# Altium schematic sheet Instigator2012ControllerBoard.SchDoc
size Letter; DocumentNumber: 1; SheetNumber: 1; SheetTotal: 4
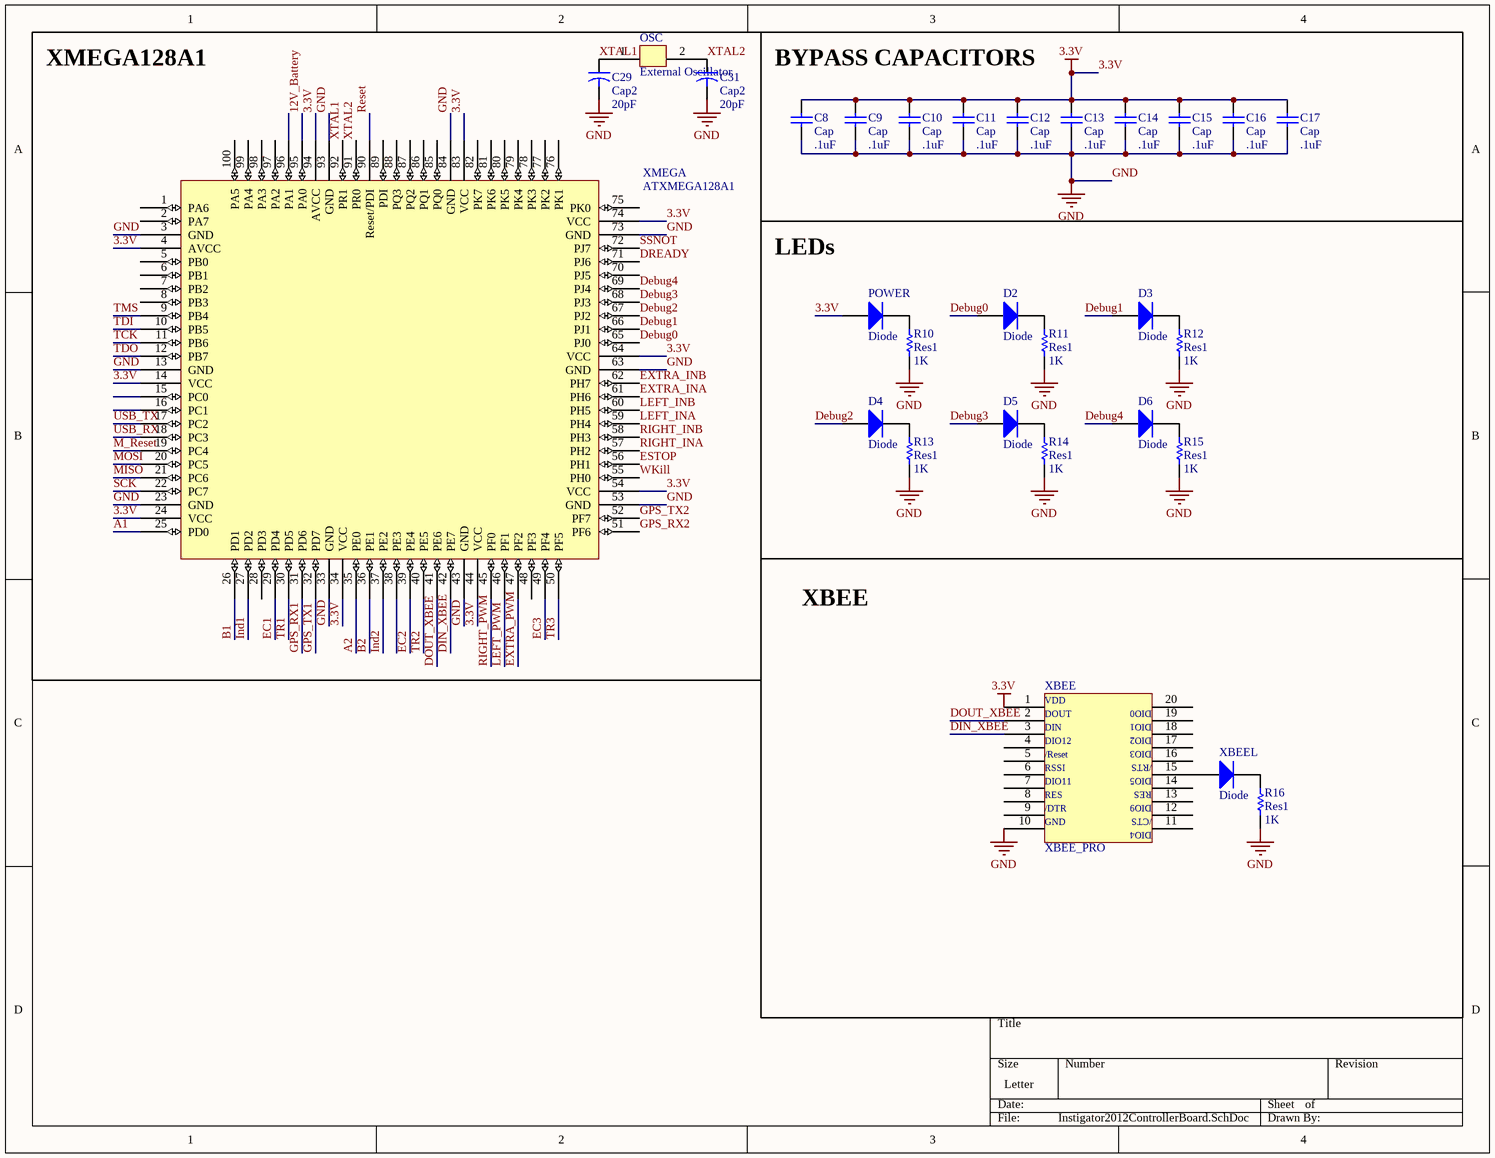
[diagram p0: Instigator2012ControllerBoard.SchDoc]

## Parts
C8  Cap  value .1uF  [1608[0603]]
C9  Cap  value .1uF  [1608[0603]]
C10  Cap  value .1uF  [1608[0603]]
C11  Cap  value .1uF  [1608[0603]]
C12  Cap  value .1uF  [1608[0603]]
C13  Cap  value .1uF  [1608[0603]]
C14  Cap  value .1uF  [1608[0603]]
C15  Cap  value .1uF  [1608[0603]]
C16  Cap  value .1uF  [1608[0603]]
C17  Cap  value .1uF  [1608[0603]]
C29  Cap2  value 20pF  [1608[0603]]
C31  Cap2  value 20pF  [1608[0603]]
D2  Diode  [1608[0603]]
D3  Diode  [1608[0603]]
D4  Diode  [1608[0603]]
D5  Diode  [1608[0603]]
D6  Diode  [1608[0603]]
OSC  External Oscillator  [PCBComponent_1 - duplicate3]
POWER  Diode  [1608[0603]]
R10  Res1  value 1K  [1608[0603]]
R11  Res1  value 1K  [1608[0603]]
R12  Res1  value 1K  [1608[0603]]
R13  Res1  value 1K  [1608[0603]]
R14  Res1  value 1K  [1608[0603]]
R15  Res1  value 1K  [1608[0603]]
R16  Res1  value 1K  [1608[0603]]
XBEE  XBEE_PRO  [PCBComponent_1]
XBEEL  Diode  [1608[0603]]
XMEGA  ATXMEGA128A1  [TSQFP50P1600X1600X120-100N]

## Blocks framed on the sheet
XMEGA128A1: C29 C31 OSC XMEGA

## Nets
3.3V: C8.2 C9.2 C10.2 C11.2 C12.2 C13.2 C14.2 C15.2 C16.2 C17.2 POWER.1(A) XBEE.1 XMEGA.4(AVCC) XMEGA.14(VCC) XMEGA.24(VCC) XMEGA.34(VCC) XMEGA.44(VCC) XMEGA.54(VCC) XMEGA.64(VCC) XMEGA.74(VCC) XMEGA.83(VCC) XMEGA.94(AVCC)
GND: C8.1 C9.1 C10.1 C11.1 C12.1 C13.1 C14.1 C15.1 C16.1 C17.1 C29.2 C31.2 R10.1 R11.1 R12.1 R13.1 R14.1 R15.1 R16.1 XBEE.10 XMEGA.3(GND) XMEGA.13(GND) XMEGA.23(GND) XMEGA.33(GND) XMEGA.43(GND) XMEGA.53(GND) XMEGA.63(GND) XMEGA.73(GND) XMEGA.84(GND) XMEGA.93(GND)
12V_Battery: XMEGA.95(PA0)
A1: XMEGA.25(PD0)
A2: XMEGA.35(PE0)
B1: XMEGA.26(PD1)
B2: XMEGA.36(PE1)
Debug0: D2.1(A) XMEGA.65(PJ0)
Debug1: D3.1(A) XMEGA.66(PJ1)
Debug2: D4.1(A) XMEGA.67(PJ2)
Debug3: D5.1(A) XMEGA.68(PJ3)
Debug4: D6.1(A) XMEGA.69(PJ4)
DIN_XBEE: XBEE.3 XMEGA.42(PE7)
DOUT_XBEE: XBEE.2 XMEGA.41(PE6)
DREADY: XMEGA.71(PJ6)
EC1: XMEGA.29(PD4)
EC2: XMEGA.39(PE4)
EC3: XMEGA.49(PF4)
ESTOP: XMEGA.56(PH1)
EXTRA_INA: XMEGA.61(PH6)
EXTRA_INB: XMEGA.62(PH7)
EXTRA_PWM: XMEGA.47(PF2)
GPS_RX1: XMEGA.31(PD6)
GPS_RX2: XMEGA.51(PF6)
GPS_TX1: XMEGA.32(PD7)
GPS_TX2: XMEGA.52(PF7)
Ind1: XMEGA.27(PD2)
Ind2: XMEGA.37(PE2)
LEFT_INA: XMEGA.59(PH4)
LEFT_INB: XMEGA.60(PH5)
LEFT_PWM: XMEGA.46(PF1)
M_Reset: XMEGA.19(PC4)
MISO: XMEGA.21(PC6)
MOSI: XMEGA.20(PC5)
Reset: XMEGA.90(Reset/PDI)
RIGHT_INA: XMEGA.57(PH2)
RIGHT_INB: XMEGA.58(PH3)
RIGHT_PWM: XMEGA.45(PF0)
SCK: XMEGA.22(PC7)
SSNOT: XMEGA.72(PJ7)
TCK: XMEGA.11(PB6)
TDI: XMEGA.10(PB5)
TDO: XMEGA.12(PB7)
TMS: XMEGA.9(PB4)
TR1: XMEGA.30(PD5)
TR2: XMEGA.40(PE5)
TR3: XMEGA.50(PF5)
USB_RX: XMEGA.18(PC3)
USB_TX: XMEGA.17(PC2)
WKill: XMEGA.55(PH0)
XTAL1: C29.1 OSC.1 XMEGA.92(PR1)
XTAL2: C31.1 OSC.2 XMEGA.91(PR0)
NetD2_2: D2.2(K) R11.2
NetD3_2: D3.2(K) R12.2
NetD4_2: D4.2(K) R13.2
NetD5_2: D5.2(K) R14.2
NetD6_2: D6.2(K) R15.2
NetPOWER_2: POWER.2(K) R10.2
NetR16_2: R16.2 XBEEL.2(K)
NetXBEE_15: XBEE.15 XBEEL.1(A)

Not connected (* = marked no-connect by the designer): XBEE 4 5 6 7 8 9 11 12 13 14 16 17 18 19 20; XMEGA 1(PA6) 2(PA7) 5(PB0) 6(PB1) 7(PB2) 8(PB3) 15(PC0) 16(PC1) 28(PD3) 38(PE3) 48(PF3) 70(PJ5) 75(PK0) 76(PK1) 77(PK2) 78(PK3) 79(PK4) 80(PK5) 81(PK6) 82(PK7) 85(PQ0) 86(PQ1) 87(PQ2) 88(PQ3) 89(PDI) 96(PA1) 97(PA2) 98(PA3) 99(PA4) 100(PA5)

## Notes on the sheet
- BYPASS CAPACITORS
- LEDs
- XBEE
- (in symbol XBEE) VDD; DIO0; DOUT; DIO1; DIN; DIO2; DIO12; DIO3; /Reset; /RTS; RSSI; DIO5; DIO11; RES; DIO9; /DTR; /CTS; GND; DIO4

## Library data of the parts
C8-C17 = Cap: Capacitor; Published: 8-Jun-2000; LatestRevisionDate: 17-Jul-2002; LatestRevisionNote: Re-released for DXP Platform.; PackageReference: RAD-0.3; Publisher: Altium Limited; PackageDescription: Radial Cap, Thru-Hole; 2 Leads; 0.3 in Pin Spacing
C29 C31 = Cap2: Capacitor; Published: 23-Sep-2002; PackageReference: CAPR5-4X5; Publisher: Altium Limited; PackageDescription: Capacitor; 2 Leads
D2-D6 POWER XBEEL = Diode: Default Diode; Published: 8-Jun-2000; LatestRevisionDate: 17-Jul-2002; LatestRevisionNote: Re-released for DXP Platform.; PackageVersion: Sep-1996; PackageReference: SMC; Publisher: Altium Limited; PackageDescription: DO-214-AB/SMC; 2 C-Bend Leads; Body 7.9 x 5.9 mm, inc. leads (LxW); Code_JEDEC: DO-214-AB
R10-R16 = Res1: Resistor; Published: 8-Jun-2000; LatestRevisionDate: 17-Jul-2002; LatestRevisionNote: Re-released for DXP Platform.; PackageReference: AXIAL-0.3; Publisher: Altium Limited; PackageDescription: Axial Device, Thru-Hole; 2 Leads; 0.3 in Pin Spacing
XBEE = XBEE